# EAGLE design teensyPCB (EAGLE 7.2.0)
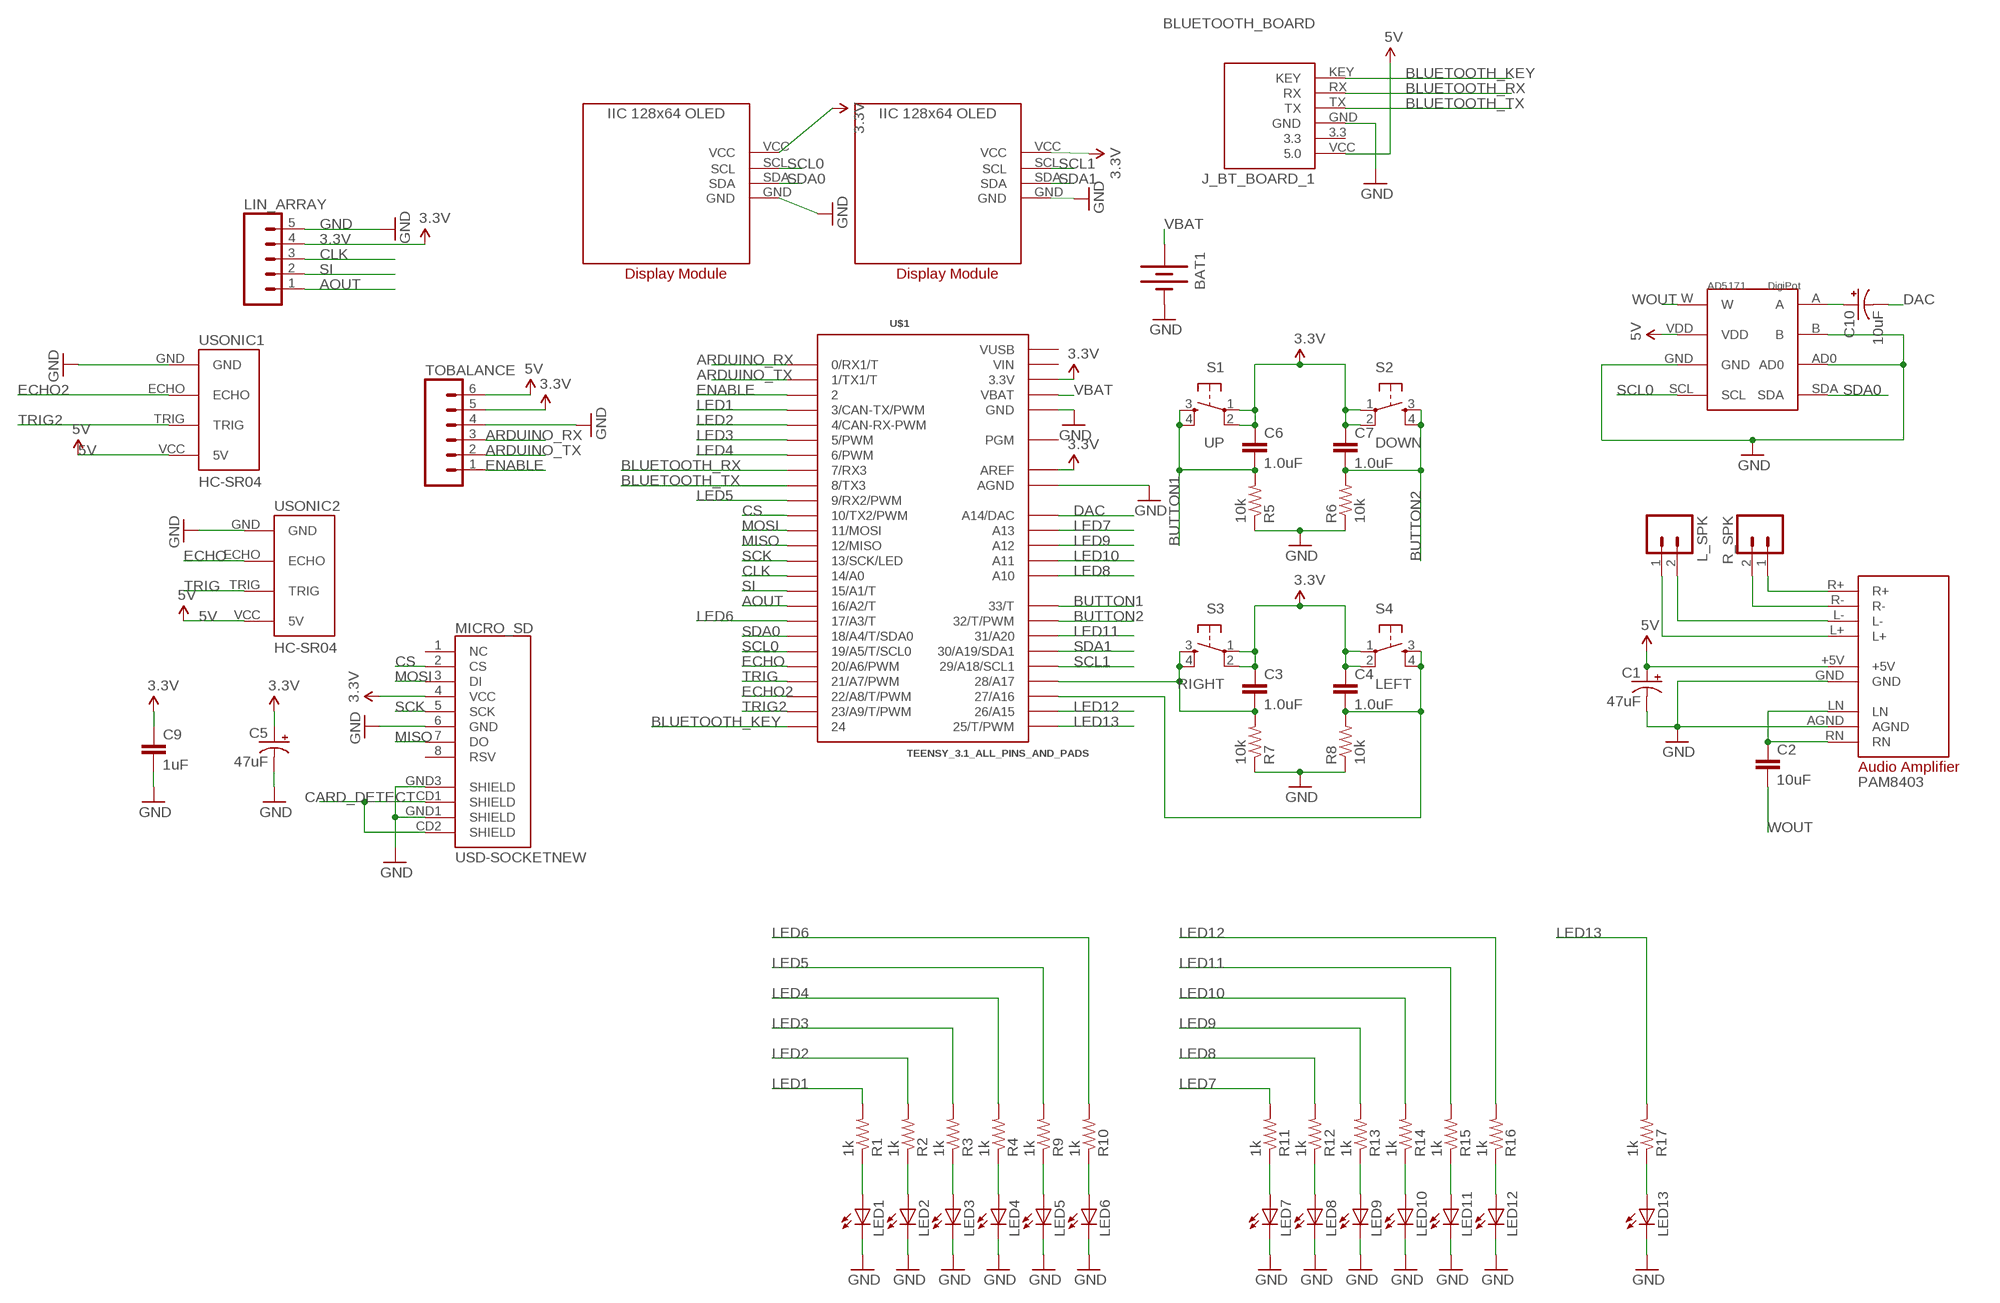
[diagram p0: schematic, sheet 1]

## Parts
BAT1  BATTERY20PTH  [BATTCOM_20MM_PTH]
C1  47uF  CAP_POL3528  [EIA3528]
C2  10uF  1.0UF-25V-+80/-20(0805)  [0805]
C3  1.0uF  1.0UF-25V-+80/-20(0805)  [0805]
C4  1.0uF  1.0UF-25V-+80/-20(0805)  [0805]
C5  47uF  CAP_POL3528  [EIA3528]
C6  1.0uF  1.0UF-25V-+80/-20(0805)  [0805]
C7  1.0uF  1.0UF-25V-+80/-20(0805)  [0805]
C9  1uF  1.0UF-25V-+80/-20(0805)  [0805]
C10  10uF  CAP_POL3528  [EIA3528]
J_BT_BOARD_1  BLUETOOTH_BOARD  [BT_BOARD_FOOTPRINT]
L_SPK  M02PTH  [1X02]
LED1  LEDCHIP-LED0805  [CHIP-LED0805]
LED2  LEDCHIP-LED0805  [CHIP-LED0805]
LED3  LEDCHIP-LED0805  [CHIP-LED0805]
LED4  LEDCHIP-LED0805  [CHIP-LED0805]
LED5  LEDCHIP-LED0805  [CHIP-LED0805]
LED6  LEDCHIP-LED0805  [CHIP-LED0805]
LED7  LEDCHIP-LED0805  [CHIP-LED0805]
LED8  LEDCHIP-LED0805  [CHIP-LED0805]
LED9  LEDCHIP-LED0805  [CHIP-LED0805]
LED10  LEDCHIP-LED0805  [CHIP-LED0805]
LED11  LEDCHIP-LED0805  [CHIP-LED0805]
LED12  LEDCHIP-LED0805  [CHIP-LED0805]
LED13  LEDCHIP-LED0805  [CHIP-LED0805]
LIN_ARRAY  M05LOCK  [1X05_LOCK]
MICRO_SD  USD-SOCKETNEW  [MICRO-SD-SOCKET-PP]
R1  1k  RESISTOR0805-RES  [0805]
R2  1k  RESISTOR0805-RES  [0805]
R3  1k  RESISTOR0805-RES  [0805]
R4  1k  RESISTOR0805-RES  [0805]
R5  10k  RESISTOR0805-RES  [0805]
R6  10k  RESISTOR0805-RES  [0805]
R7  10k  RESISTOR0805-RES  [0805]
R8  10k  RESISTOR0805-RES  [0805]
R9  1k  RESISTOR0805-RES  [0805]
R10  1k  RESISTOR0805-RES  [0805]
R11  1k  RESISTOR0805-RES  [0805]
R12  1k  RESISTOR0805-RES  [0805]
R13  1k  RESISTOR0805-RES  [0805]
R14  1k  RESISTOR0805-RES  [0805]
R15  1k  RESISTOR0805-RES  [0805]
R16  1k  RESISTOR0805-RES  [0805]
R17  1k  RESISTOR0805-RES  [0805]
R_SPK  M02PTH  [1X02]
S1  UP  TAC_SWITCHSMD  [TACTILE-SWITCH-SMD]
S2  DOWN  TAC_SWITCHSMD  [TACTILE-SWITCH-SMD]
S3  RIGHT  TAC_SWITCHSMD  [TACTILE-SWITCH-SMD]
S4  LEFT  TAC_SWITCHSMD  [TACTILE-SWITCH-SMD]
TOBALANCE  M06POLAR_LOCK  [MOLEX-1X6_LOCK]
U$1  TEENSY_3.1_ALL_PINS_AND_PADS  [TEENSY3_ALL_PINS_&_PADS]
U$2  IIC128X64OLED  [IIC128X64OLED]
U$3  IIC128X64OLED  [IIC128X64OLED]
U$4  AUDIOAMPEBAY_VERSION  [AUDIOAMP]
U$5  DIGIPOT  [SOT23-8L]
USONIC1  HC-SR04  [HC-SR04_FOOTPRINT]
USONIC2  HC-SR04  [HC-SR04_FOOTPRINT]

## Nets
3.3V [Power]: C3.1 C4.1 C5.A(+) C6.1 C7.1 C9.1 LIN_ARRAY.4 MICRO_SD.4(VCC) S1.1 S1.2 S2.1 S2.2 S3.1 S3.2 S4.1 S4.2 TOBALANCE.5 U$1.3.3V U$1.3.3V1(3.3V) U$1.3.3V2(3.3V) U$1.AREF U$2.VCC U$3.VCC
5V [Power]: C1.A(+) J_BT_BOARD_1.VCC(5.0) TOBALANCE.6 U$4.+5V U$5.VDD USONIC1.VCC(5V) USONIC2.VCC(5V)
AOUT: LIN_ARRAY.1 U$1.16/A2(16/A2/T)
ARDUINO_RX: TOBALANCE.3 U$1.0(0/RX1/T)
ARDUINO_TX: TOBALANCE.2 U$1.1(1/TX1/T)
BLUETOOTH_KEY: J_BT_BOARD_1.KEY U$1.24
BLUETOOTH_RX: J_BT_BOARD_1.RX U$1.7(7/RX3)
BLUETOOTH_TX: J_BT_BOARD_1.TX U$1.8(8/TX3)
BUTTON1: C6.2 R5.2 S1.3 S1.4 U$1.33(33/T)
BUTTON2: C7.2 R6.2 S2.3 S2.4 U$1.32(32/T/PWM)
BUTTON3: C3.2 R7.2 S3.3 S3.4 U$1.28(28/A17)
BUTTON4: C4.2 R8.2 S4.3 S4.4 U$1.27(27/A16)
CARD_DETECT: MICRO_SD.CD1(SHIELD) MICRO_SD.CD2(SHIELD)
CLK: LIN_ARRAY.3 U$1.14/A0
CS: MICRO_SD.2(CS) U$1.10(10/TX2/PWM)
DAC: C10.C(-) U$1.RESET/DAC(A14/DAC)
ECHO: U$1.20/A6(20/A6/PWM) USONIC2.ECHO
ECHO2: U$1.22/A8(22/A8/T/PWM) USONIC1.ECHO
ENABLE: TOBALANCE.1 U$1.2
GND [Power]: BAT1.2(-) C1.C(-) C5.C(-) C9.2 J_BT_BOARD_1.GND LED1.C LED2.C LED3.C LED4.C LED5.C LED6.C LED7.C LED8.C LED9.C LED10.C LED11.C LED12.C LED13.C LIN_ARRAY.5 MICRO_SD.6(GND) MICRO_SD.GND1(SHIELD) MICRO_SD.GND3(SHIELD) R5.1 R6.1 R7.1 R8.1 TOBALANCE.4 U$1.AGND U$1.GND U$1.GND1(GND) U$1.GND2(GND) U$2.GND U$3.GND U$4.AGND U$4.GND U$5.AD0 U$5.B U$5.GND USONIC1.GND USONIC2.GND
LED1: R1.2 U$1.3(3/CAN-TX/PWM)
LED2: R2.2 U$1.4(4/CAN-RX-PWM)
LED3: R3.2 U$1.5(5/PWM)
LED4: R4.2 U$1.6(6/PWM)
LED5: R9.2 U$1.9(9/RX2/PWM)
LED6: R10.2 U$1.17/A3(17/A3/T)
LED7: R11.2 U$1.A13
LED8: R12.2 U$1.A10
LED9: R13.2 U$1.A12
LED10: R14.2 U$1.A11
LED11: R15.2 U$1.31(31/A20)
LED12: R16.2 U$1.26(26/A15)
LED13: R17.2 U$1.25(25/T/PWM)
MISO: MICRO_SD.7(DO) U$1.12(12/MISO)
MOSI: MICRO_SD.3(DI) U$1.11(11/MOSI)
N$1: C2.1 U$4.LN U$4.RN
N$2: C10.A(+) U$5.A
N$5: R_SPK.1 U$4.R+
N$6: R_SPK.2 U$4.R-
N$7: L_SPK.2 U$4.L-
N$8: L_SPK.1 U$4.L+
N$11: LED1.A R1.1
N$12: LED2.A R2.1
N$13: LED3.A R3.1
N$14: LED4.A R4.1
N$15: LED5.A R9.1
N$16: LED6.A R10.1
N$17: LED7.A R11.1
N$18: LED8.A R12.1
N$19: LED9.A R13.1
N$20: LED10.A R14.1
N$21: LED11.A R15.1
N$22: LED12.A R16.1
N$23: LED13.A R17.1
SCK: MICRO_SD.5(SCK) U$1.13(13/SCK/LED)
SCL0: U$1.19/A5(19/A5/T/SCL0) U$2.SCL U$5.SCL
SCL1: U$1.29(29/A18/SCL1) U$3.SCL
SDA0: U$1.18/A4(18/A4/T/SDA0) U$2.SDA U$5.SDA
SDA1: U$1.30(30/A19/SDA1) U$3.SDA
SI: LIN_ARRAY.2 U$1.15/A1(15/A1/T)
TRIG: U$1.21/A7(21/A7/PWM) USONIC2.TRIG
TRIG2: U$1.23/A9(23/A9/T/PWM) USONIC1.TRIG
VBAT: BAT1.1(+) U$1.VBAT
WOUT: C2.2 U$5.W
Unconnected: J_BT_BOARD_1.3.3 MICRO_SD.1(NC) MICRO_SD.8(RSV) U$1.PGM

## Power pins joined to a net without a drawn wire
VIN: U$1.VIN
VUSB: U$1.VUSB

## Library data of the parts
BAT1 = SparkFun-Electromechanical:BATTERY: Battery Holders Various common sizes : AA, AAA, 18650 (PRT-12895), 20mm coin cell and 12mm coin cell. 20MM_4LEGS, BATT-10373
C1 C5 C10 = SparkFun-Capacitors:CAP_POL: Capacitor Polarized These are standard SMD and PTH capacitors. Normally 10uF, 47uF, and 100uF in electrolytic and tantalum varieties. Always verify the external diameter of the through hole cap, it varies with capacity, voltage, and manufacturer. The EIA devices should be standard.
C2 C9 = SparkFun-Capacitors:1.0UF-25V-+80/-20(0805): CAP-11625; PROD_ID: CAP-11625; VALUE: 1.0uF
C3 C4 C6 C7 = SparkFun-Capacitors:1.0UF-25V-+80/-20(0805): CAP-11625; PROD_ID: CAP-11625
J_BT_BOARD_1 = Bluetooth_HC-05:BLUETOOTH_BOARD: Bluetooth Board V1.05
L_SPK R_SPK = SparkFun-Connectors:M02: Standard 2-pin 0.1" header. Use with - straight break away headers ( PRT-00116) - right angle break away headers (PRT-00553) - swiss pins (PRT-00743) - machine pins (PRT-00117) - female headers (PRT-00115) Molex polarized connector foot print use with: PRT-08233 with associated crimp pins and housings. 2.54_SCREWTERM for use with PRT-10571. 3.5mm Screw Terminal footprints for PRT-08084 5mm Screw Terminal footprints for use with PRT-08432
LED1-LED13 = adafruit:LED: LED OSRAM: - CHIPLED LG R971, LG N971, LY N971, LG Q971, LY Q971, LO R971, LY R971 LH N974, LH R974 LS Q976, LO Q976, LY Q976 LO Q996 - Hyper CHIPLED LW Q18S LB Q993, LB Q99A, LB R99A - SideLED LS A670, LO A670, LY A670, LG A670, LP A670 LB A673, LV A673, LT A673, LW A673 LH A674 LY A675 LS A676, LA A676, LO A676, LY A676, LW A676 LS A679, LY A679, LG A679 - Hyper Micro SIDELED® LS Y876, LA Y876, LO Y876, LY Y876 LT Y87S - SmartLED LW L88C, LW L88S LB L89C, LB L89S, LG L890 LS L89K, LO L89K, LY L89K LS L896, LA L896, LO L896, LY L896 - TOPLED LS T670, LO T670, LY T670, LG T670, LP T670 LSG T670, LSP T670, LSY T670, LOP T670, LYG T670 LG T671, LOG T671, LSG T671 LB T673, LV T673, LT T673, LW T673 LH T674 LS T676, LA T676, LO T676, LY T676, LB T676, LH T676, LSB T676, LW T676 LB T67C, LV T67C, LT T67C, LS T67K, LO T67K, LY T67K, LW E67C LS E67B, LA E67B, LO E67B, LY E67B, LB E67C, LV E67C, LT E67C LW T67C LS T679, LY T679, LG T679 LS T770, LO T770, LY T770, LG T770, LP T770 LB T773, LV T773, LT T773, LW T773 LH T774 LS E675, LA E675, LY E675, LS T675 LS T776, LA T776, LO T776, LY T776, LB T776 LHGB T686 LT T68C, LB T68C - Hyper Mini TOPLED® LB M676 - Mini TOPLED Santana® LG M470 LS M47K, LO M47K, LY M47K Source: http://www.osram.convergy.de/
LIN_ARRAY = SparkFun-Connectors:M05: Header 5 Standard 5-pin 0.1" header. Use with straight break away headers (SKU : PRT-00116), right angle break away headers (PRT-00553), swiss pins (PRT-00743), machine pins (PRT-00117), and female headers (PRT-00115). Molex polarized connector foot print use with SKU : PRT-08230 with associated crimp pins and housings.
MICRO_SD = SparkFun-Connectors:USD-SOCKET: microSD Socket Push-push type uSD socket. Schematic element and footprint production proven. Spark Fun Electronics SKU : PRT-00127. tDoc lines correctly indicate media card edge positions when inserting (unlocked, locked, depressed).
R1-R17 = SparkFun-Resistors:RESISTOR: Resistor Basic schematic elements and footprints for 0603, 1206, and PTH resistors.
S1-S4 = SparkFun-Retired:TAC_SWITCH: Momentary Switch Button commonly used for reset or general input. Spark Fun Electronics SKU : COM-00097 SMT- SWCH-08247; PROD_ID: SWCH-08247; VALUE: TAC_SWITCHSMD
TOBALANCE = SparkFun-Connectors:M06: Header 6 Standard 6-pin 0.1" header. Use with straight break away headers (SKU : PRT-00116), right angle break away headers (PRT-00553), swiss pins (PRT-00743), machine pins (PRT-00117), and female headers (PRT-00115). Molex polarized connector foot print use with SKU : PRT-08094 with associated crimp pins and housings. NOTES ON THE VARIANTS LOCK and LOCK_LONGPADS... This footprint was designed to help hold the alignment of a through-hole component (i.e. 6-pin header) while soldering it into place. You may notice that each hole has been shifted either up or down by 0.005 of an inch from it's more standard position (which is a perfectly straight line). This slight alteration caused the pins (the squares in the middle) to touch the edges of the holes. Because they are alternating, it causes a "brace" to hold the component in place. 0.005 has proven to be the perfect amount of "off-center" position when using our standard breakaway headers. Although looks a little odd when you look at the bare footprint, once you have a header in there, the alteration is very hard to notice. Also,if you push a header all the way into place, it is covered up entirely on the bottom side. This idea of altering the position of holes to aid alignment will be further integrated into the Sparkfun Library for other footprints. It can help hold any component with 3 or more connection pins.
U$1 = Teensy_3_and_LC_Series_Boards_v1.1:TEENSY_3.1_ALL_PINS_AND_PADS: Footprint for Teensy 3.1 or 3.2 board using all pads and all through-holes. Pads need a 2x7 0.1" SMD header.
U$2 U$3 = IIC OLED MODULE LIBRARY:IIC128X64OLED
U$4 = CLASS D AUDIO AMP:AUDIOAMP
U$5 = DigiPot:DIGIPOT
USONIC1 USONIC2 = HC-SR04:HC-SR04: Ultrasonic Sensor HC-SR04

## Net classes
0 default: width 0.254 mm
1 Power: width 0.305 mm

## Board
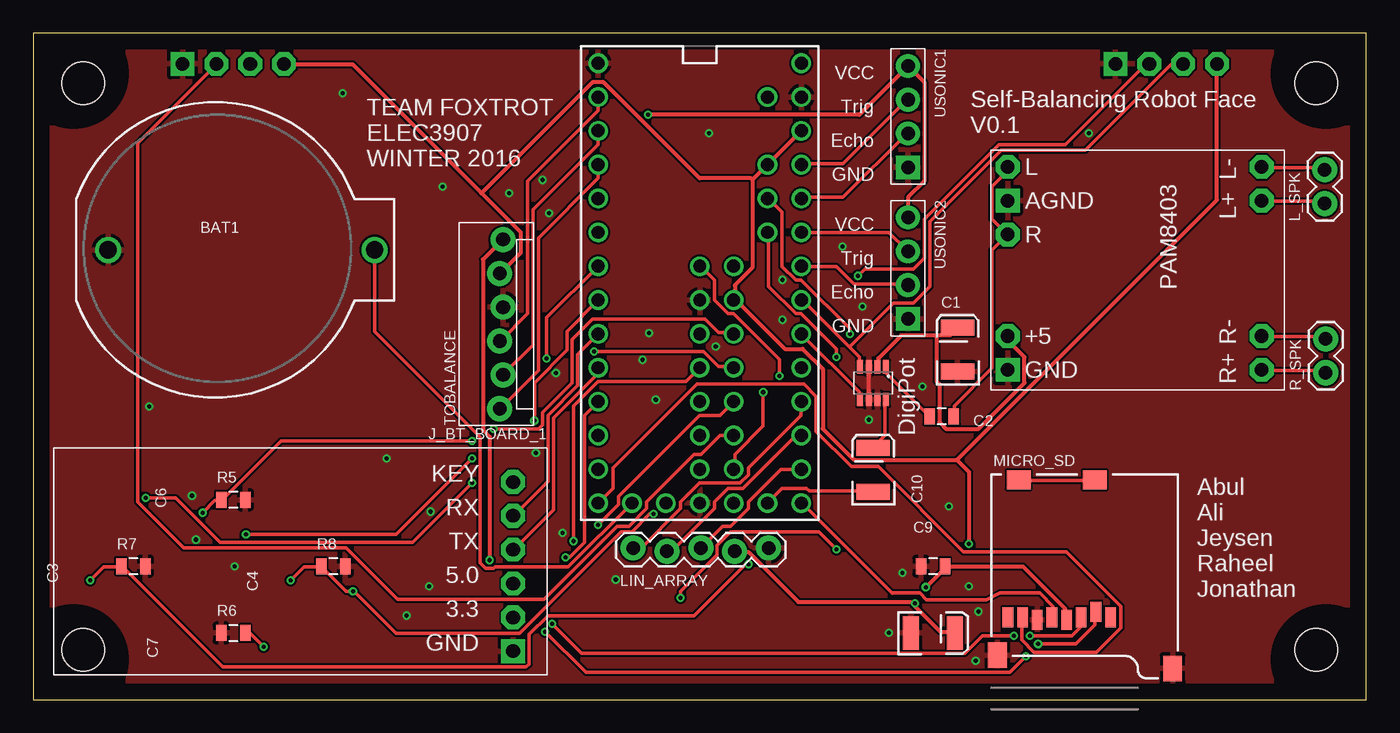
[diagram p1: board, top side]
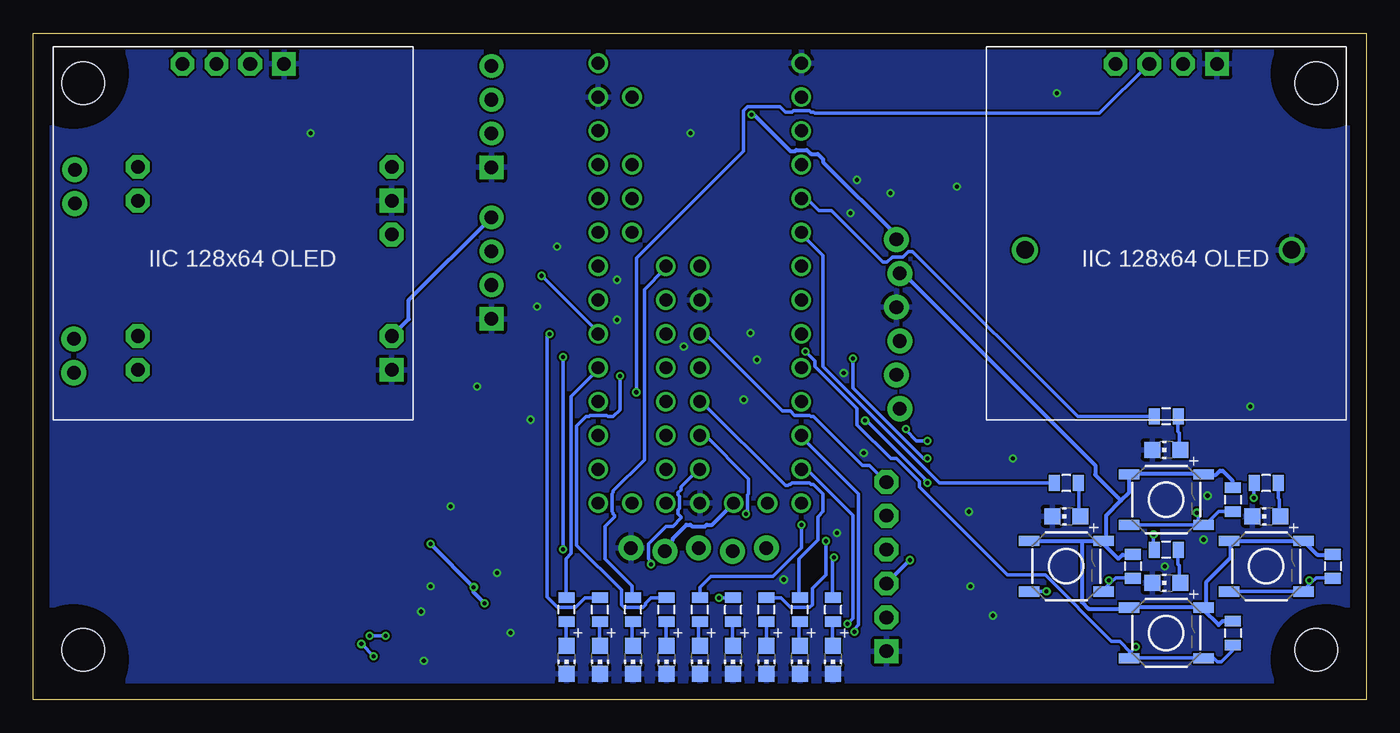
[diagram p2: board, bottom side, seen from below]

Size 100 x 50 mm. Coordinates in mm from the lower left corner, seen from the top.
Outline: 0,0 100,0 100,50 0,50 0,0
Copper layers (1*16): Top 0.035mm / dielectric 1.5mm / Bottom 0.035mm
Design rules "ITEADstudio_DRC": minimum track width 6mil, minimum drill 12mil, track to track 6mil, track to pad 6mil, pad to pad 6mil, via to via 6mil, smd to smd 0mil, copper to edge 10mil, drill to drill 10mil, minimum pad ring 10mil, minimum via ring 6mil, stop-mask expansion 2mil, vias tented up to drill 100mil, thermal gap 10mil
Holes 3.2 mm at 3.75,46.25 96.25,46.25 96.25,3.75 3.75,3.75
tRestrict: area 0,0 to 100,50; area 0.8,0.8 to 5.2,5.2; area 0.8,44.8 to 5.2,49.2; area 94.8,44.8 to 99.2,49.2; area 94.8,0.8 to 99.2,5.2
bRestrict: area 0,0 to 100,50; area 0.8,44.8 to 5.2,49.2; area 0.8,0.8 to 5.2,5.2; area 94.8,44.8 to 99.2,49.2; area 94.8,0.8 to 99.2,5.2

### Footprints (pad centres in the part's own frame; a part is rotated, then mirrored left to right if it is on the bottom)
BATTCOM_20MM_PTH = drill 1.3: 1 11.85,0; 2 -8.15,0
EIA3528 = smd 1.2 x 2.5: A 1.65,0; C -1.65,0
0805 = smd 0.8 x 1.2: 1 -0.9,0; 2 0.9,0
BT_BOARD_FOOTPRINT = drill 1.016 pad 1.778 octagon: 3.3 2.54,12.7; KEY 2.54,2.54; RX 2.54,5.08; TX 2.54,7.62; VCC 2.54,10.16 | drill 1.016 pad 1.778 square: GND 2.54,15.24
1X02 = drill 1.016 pad 1.88: 1 0,0; 2 2.54,0
CHIP-LED0805 = smd 1.2 x 1.2: A 0,-1.05; C 0,1.05
1X05_LOCK = drill 1.016 pad 1.88: 1 0,0.127; 2 2.54,-0.127; 3 5.08,0.127; 4 7.62,-0.127; 5 10.16,0.127
MICRO-SD-SOCKET-PP = smd 0.8 x 1.5: 1 -8.94,10.7; 2 -7.84,10.3; 3 -6.74,10.7; 4 -5.64,10.9; 5 -4.54,10.7; 6 -3.44,10.9; 7 -2.34,10.7; 8 -1.24,10.7 | smd 1.8 x 1.4: CD1 -2.05,0.4; CD2 -7.75,0.4 | smd 1.4 x 1.9: GND1 -13.6,14.55; GND3 -0.45,13.55
TACTILE-SWITCH-SMD = smd 1.524 x 0.762: 1 -2.794,1.905; 2 2.794,1.905; 3 -2.794,-1.905; 4 2.794,-1.905
MOLEX-1X6_LOCK = drill 1.016 pad 1.88: 1 0,0; 2 2.54,-0.254; 3 5.08,0; 4 7.62,-0.254; 5 10.16,0; 6 12.7,-0.254
TEENSY3_ALL_PINS_&_PADS = drill 0.965: 0 -7.62,13.97; 1 -7.62,11.43; 2 -7.62,8.89; 3 -7.62,6.35; 3.3V 7.62,11.43; 3.3V1 -2.54,-16.51; 3.3V2 2.54,-1.27; 4 -7.62,3.81; 5 -7.62,1.27; 6 -7.62,-1.27; 7 -7.62,-3.81; 8 -7.62,-6.35; 9 -7.62,-8.89; 10 -7.62,-11.43; 11 -7.62,-13.97; 12 -7.62,-16.51; 13 7.62,-16.51; 14/A0 7.62,-13.97; 15/A1 7.62,-11.43; 16/A2 7.62,-8.89; 17/A3 7.62,-6.35; 18/A4 7.62,-3.81; 19/A5 7.62,-1.27; 20/A6 7.62,1.27; 21/A7 7.62,3.81; 22/A8 7.62,6.35; 23/A9 7.62,8.89; 24 0,-3.81; 25 0,-6.35; 26 0,-8.89; 27 0,-11.43; 28 0,-13.97; 29 2.54,-13.97; 30 2.54,-11.43; 31 2.54,-8.89; 32 2.54,-6.35; 33 2.54,-3.81; A10 5.08,6.35; A11 5.08,3.81; A12 0,1.27; A13 2.54,1.27; AGND 7.62,13.97; AREF 5.08,8.89; GND -7.62,16.51; GND1 0,-16.51; GND2 0,-1.27; PGM 2.54,-16.51; RESET/DAC 5.08,-16.51; VBAT -5.08,-16.51; VIN 7.62,16.51; VUSB 5.08,13.97
IIC128X64OLED = drill 1.016 pad 1.778 square: GND 3.81,12.7 | drill 1.016 pad 1.778 octagon: SCL -1.27,12.7; SDA 1.27,12.7; VCC -3.81,12.7
AUDIOAMP = drill 1.016 pad 1.778 octagon: +5V 13.97,1.27; L+ 3.81,20.32; L- 1.27,20.32; LN 1.27,1.27; R+ 16.51,20.32; R- 13.97,20.32; RN 6.35,1.27 | drill 1.016 pad 1.778 square: AGND 3.81,1.27; GND 16.51,1.27
SOT23-8L = smd 0.45 x 1: A -0.975,1.225; AD0 0.325,1.225; B -0.325,1.225; GND 0.325,-1.225; SCL 0.975,-1.225; SDA 0.975,1.225; VDD -0.325,-1.225; W -0.975,-1.225
HC-SR04_FOOTPRINT = drill 1.016 pad 1.778: ECHO 0,1.27; TRIG 0,-1.27; VCC 0,-3.81 | drill 1.016 pad 1.778 square: GND 0,3.81

### Placement (x,y rotation side)
BAT1  13.75,33.75 0 top
C1  69.34,26.26 90 top
C2  68.14,21.25 180 top
C3  2.5,10 270 bottom
C4  17.5,10 270 bottom
C5  67.5,5 0 top
C6  10,15 270 bottom
C7  10,5 270 bottom
C9  67.5,10 180 top
C10  63,17.25 90 top
J_BT_BOARD_1  38.53,18.86 180 top
L_SPK  96.89,37.23 90 top
LED1  15,18.75 90 bottom
LED2  22.5,13.75 90 bottom
LED3  15,8.75 90 bottom
LED4  7.5,13.75 90 bottom
LED5  40,3 180 bottom
LED6  60,3 180 bottom
LED7  55,3 180 bottom
LED8  57.5,3 180 bottom
LED9  52.5,3 180 bottom
LED10  47.5,3 180 bottom
LED11  50,3 180 bottom
LED12  42.5,3 180 bottom
LED13  45,3 180 bottom
LIN_ARRAY  45,11.25 0 top
MICRO_SD  71.88,16.89 180 top
R1  15,21.25 180 bottom
R2  22.5,16.25 180 bottom
R3  15,11.25 180 bottom
R4  7.5,16.25 180 bottom
R5  15,15 180 top
R6  15,5 0 top
R7  7.5,10 180 top
R8  22.5,10 180 top
R9  40,6.75 90 bottom
R10  60,6.75 90 bottom
R11  55,6.75 90 bottom
R12  57.5,6.75 90 bottom
R13  52.5,6.75 90 bottom
R14  47.5,6.75 90 bottom
R15  50,6.75 90 bottom
R16  42.5,6.75 90 bottom
R17  45,6.75 90 bottom
R_SPK  96.95,24.52 90 top
S1  15,15 0 bottom
S2  15,5 0 bottom
S3  7.5,10 0 bottom
S4  22.5,10 0 bottom
TOBALANCE  34.99,21.82 90 top
U$1  50,31.25 0 top
U$2  85,35 0 bottom
U$3  15,35 0 bottom
U$4  71.84,41.25 270 top
U$5  63,23.75 180 top
USONIC1  65.62,43.75 180 top
USONIC2  65.62,32.38 180 top

### Tracks (layer width: path | path; a pad name or v marks a point on that pad's centre or on a via)
3.3V  (via drill 0.3)
  Top 0.305: 33.63,38 36.58,35.05 36.58,33.53 35.05,32 TOBALANCE.5 | 33.63,38 23.98,47.65 18.9,47.65 U$3.VCC | MICRO_SD.4 77.42,5.99 77.42,6.81 74.27,9.96 68.48,9.96 C9.1 68.38,9.86 v66.95,8.43 | 66.04,7.11 65.84,7.32 57.4,7.32 53.65,11.07 52.63,11.07 LIN_ARRAY.4 | 66.04,7.11 68.07,5.08 69.09,5.08 C5.A | v66.14,7.21 66.04,7.11 | 53.95,39.01 53.95,32.41 52.63,31.09 52.63,30.07 U$1.3.3V2 52.73,29.97 56.39,26.31 57.71,26.31 59.23,24.79 59.23,20.32 61.57,17.98 69.29,17.98 | 53.95,39.01 55.07,40.13 U$1.AREF 55.17,40.23 57.61,42.67 U$1.3.3V | 69.29,17.98 88.8,37.49 88.8,47.65 U$2.VCC | v70.21,11.68 70.21,17.07 69.29,17.98 | 33.63,38 41.96,46.33 42.77,46.33 49.99,39.12 53.85,39.12 53.95,39.01
  Bottom 0.305: C3.1 2.54,10.87 3.66,10.87 4.67,11.89 S3.2 4.78,11.89 10.26,11.89 S3.1 10.16,11.79 10.16,10.67 11.99,8.84 11.99,7.21 12.19,7.01 S2.2 | C7.1 10.06,5.89 10.77,5.89 11.07,5.59 12.29,6.81 S2.2 | S2.2 12.39,6.91 S2.1 17.88,6.81 20.83,6.81 21.34,7.32 21.34,11.89 | C6.1 10.06,15.95 10.06,16.46 10.77,17.17 10.97,17.17 11.28,16.87 12.19,16.87 S1.2 12.29,16.97 17.68,16.97 S1.1 17.78,16.87 17.78,15.54 18.39,14.94 | C4.1 17.58,10.87 18.29,10.87 18.59,10.57 19.61,11.58 19.61,11.89 S4.2 | 18.39,14.94 19.51,13.82 19.51,11.99 S4.2 | 21.34,11.89 19.81,11.89 S4.2 | 21.34,11.89 25.2,11.89 S4.1 | 18.39,14.94 20.32,16.87 20.32,17.58 34.65,31.9 34.95,31.9 TOBALANCE.5 | U$1.3.3V1 47.55,14.73 47.85,14.43 47.85,14.33 49.07,13.11 49.48,13.11 49.58,13.01 50.6,13.01 50.7,13.11 51,13.11 52.02,12.09 52.02,11.99 52.53,11.48 52.53,11.18 LIN_ARRAY.4 | v66.14,7.21 66.95,8.03 v66.95,8.43 v70.21,11.68
5V  (via drill 0.3)
  Top 0.305: v34.24,10.46 34.24,19.71 33.73,20.22 33.73,33.02 35.15,34.44 TOBALANCE.6 | USONIC2.VCC 65.63,36.27 65.63,37.69 66.85,38.91 66.85,46.33 65.63,47.55 USONIC1.VCC 65.53,47.45 61.98,43.89 v46.13,43.89 | 67.77,27.33 68.78,27.33 69.29,27.84 C1.A | 67.77,27.33 65.13,27.33 63.4,25.6 63.4,24.99 U$5.VDD | 67.77,27.33 67.77,23.88 67.97,23.67 67.97,20.83 68.48,20.32 70.92,20.32 74.37,23.77 74.37,25.7 73.15,26.92 73.15,27.23 U$4.+5V
  Bottom 0.305: v34.24,10.46 35.97,8.74 J_BT_BOARD_1.VCC | USONIC2.VCC 65.63,36.17 71.83,29.97 71.83,28.55 73.05,27.33 U$4.+5V | v46.13,43.89 45.92,43.89 43.18,41.15 42.88,41.15 42.77,41.25 41.96,41.25 41.66,40.95 41.15,40.95 40.74,40.54 40.74,40.34 35.26,34.85 35.26,34.54 TOBALANCE.6
AOUT
  Top 0.254: U$1.16/A2 57.61,22.35 57.61,21.34 53.65,17.37 53.65,16.87 53.03,16.26 49.99,16.26 48.56,14.83 48.56,14.33 45.62,11.38 LIN_ARRAY.1
ARDUINO_RX
  Top 0.254: U$1.0 42.37,45.21 42.37,44.2 37.08,38.91 37.08,28.96 35.05,26.92 TOBALANCE.3
ARDUINO_TX
  Top 0.254: U$1.1 42.37,42.67 42.37,41.66 37.49,36.78 37.49,26.62 35.26,24.38 TOBALANCE.2
BLUETOOTH_KEY
  Bottom 0.254: U$1.24 49.99,27.43 49.58,27.43 43.79,21.64 43.18,21.64 42.88,21.34 41.76,21.34 41.66,21.23 41.45,21.23 37.8,17.58 37.29,17.58 36.07,16.36 J_BT_BOARD_1.KEY
BLUETOOTH_RX
  Top 0.254: U$1.7 42.37,27.43 40.84,25.91 40.84,23.57 38.61,21.34 38.61,16.36 36.07,13.82 J_BT_BOARD_1.RX
BLUETOOTH_TX
  Top 0.254: U$1.8 42.37,24.89 42.37,24.49 39.01,21.13 39.01,14.22 36.07,11.28 J_BT_BOARD_1.TX
BUTTON1  (via drill 0.3)
  Top 0.254: v12.7,14.02 13.61,14.94 14.02,14.94 R5.2 14.22,15.04 18.59,19.41 v32.92,19.41 | v34.54,20.32 37.9,20.32 38.2,20.62 38.2,21.54 40.44,23.77 40.44,27.03 41.96,28.55 50.39,28.55 51.41,27.53 52.53,27.53 U$1.33
  Bottom 0.254: C6.2 10.06,14.12 11.07,14.12 12.19,13.01 S1.4 | v12.7,14.02 12.6,13.92 12.6,13.41 12.29,13.11 S1.4 | S1.3 12.8,13.11 12.6,13.31 S1.4 | v34.54,20.32 34.54,20.22 33.73,19.41 v32.92,19.41
BUTTON2  (via drill 0.3)
  Top 0.254: v17.27,3.96 16.26,4.98 15.95,4.98 R6.2 | v42.06,26.11 50.29,26.11 51.41,24.99 52.53,24.99 U$1.32
  Bottom 0.254: C7.2 10.06,4.06 10.06,3.66 10.87,2.85 11.18,2.85 11.48,3.15 12.19,3.15 S2.4 12.29,3.15 17.68,3.15 S2.3 17.88,3.15 17.88,3.35 17.68,3.56 | 17.68,3.56 v17.27,3.96 | v42.06,26.11 41.35,25.4 41.35,24.99 38.2,21.84 38.2,20.62 35.66,18.09 35.26,18.09 33.53,16.36 33.53,15.95 26.92,9.35 24.08,9.35 19.1,4.37 18.49,4.37 17.68,3.56
BUTTON3  (via drill 0.3)
  Top 0.254: v4.27,8.94 5.28,9.96 6.5,9.96 R7.2 6.71,9.96 14.22,2.44 36.98,2.44 37.19,2.64 37.19,4.88 38.61,6.3 49.58,6.3 53.44,10.16 v53.65,10.16
  Bottom 0.254: 4.12,8.79 4.78,8.13 S3.4 4.88,8.13 10.26,8.13 S3.3 | 4.12,8.79 3.76,9.14 2.54,9.14 C3.2 | 4.12,8.79 v4.27,8.94 | v53.65,10.16 53.54,10.26 53.85,10.57 53.85,11.68 52.53,13.01 52.02,13.01 51.41,13.61 51.41,13.72 51.61,13.92 51.61,14.22 51.51,14.33 51.51,15.24 51.61,15.34 51.61,15.54 51.41,15.75 51.41,15.95 50.09,17.27 U$1.28
BUTTON4  (via drill 0.3)
  Top 0.254: v19.3,8.94 20.32,9.96 21.54,9.96 R8.2 21.64,9.96 23.47,8.13 v23.98,8.13 24.08,8.13 27.23,4.98 36.47,4.98 44.09,12.6 44.91,12.6 46.23,13.92 v46.53,13.92
  Bottom 0.254: 19.15,8.79 19.61,8.33 19.61,8.13 S4.4 | 19.15,8.79 18.8,9.14 17.58,9.14 C4.2 | 19.15,8.79 v19.3,8.94 | v23.98,8.13 25.2,8.13 S4.3 | v46.53,13.92 46.43,14.02 46.43,15.34 46.33,15.44 46.33,16.56 49.58,19.81 49.99,19.81 U$1.27
CARD_DETECT
  Top 0.254: MICRO_SD.CD1 73.97,16.46 79.55,16.46 MICRO_SD.CD2
CLK
  Top 0.254: U$1.14/A0 57.61,17.27 56.08,17.27 53.65,14.83 53.65,14.33 52.32,13.01 51.71,13.01 LIN_ARRAY.3
CS  (via drill 0.3)
  Top 0.254: v75.39,4.17 78.23,4.17 79.65,5.59 79.65,6.5 MICRO_SD.2 | v74.47,3.25 73.25,2.03 41.45,2.03 v38.41,5.08
  Bottom 0.254: v74.47,3.25 v75.39,4.17 | v38.41,5.08 38.41,5.28 38.1,5.59 38.1,15.44 42.47,19.81 U$1.10
DAC
  Top 0.254: C10.C 62.99,15.65 58.22,15.65 58.01,15.85 56.19,15.85 55.17,14.83 U$1.RESET/DAC
ECHO
  Top 0.254: U$1.20/A6 57.71,32.51 60.25,32.51 61.57,31.19 65.53,31.19 USONIC2.ECHO
ECHO2
  Top 0.254: U$1.22/A8 57.71,37.69 60.76,37.69 65.53,42.47 USONIC1.ECHO
ENABLE
  Top 0.254: U$1.2 42.37,40.13 42.37,39.12 37.9,34.65 37.9,24.69 35.05,21.84 TOBALANCE.1
GND  (via drill 0.3)
  Top 0.305: U$5.AD0 U$5.GND | 63.4,22.55 U$5.B 63.4,22.55
  other vias: 15.1,10 26.5,18.1 28,6.3 64.2,5 70.7,2.9 70.9,6.6 65.2,9.5 8.7,22 23.2,45.5 30.7,38.5 50.7,42.5 35.7,38 38.2,39 38.7,36.5 29.7,8.5 70.2,8.5 68.7,14.5 66.7,23.5 62.7,21 62.2,29.5 60.7,34 79.2,42.5 12.2,12 39.7,12.5 46.7,22.5 45.7,25.5 46.2,27.5 51.2,26.5 56.2,28.5 56.2,31.5 43.7,9 39.2,24.5 37.7,18.5 29.8,14.1 11.9,15.3
  pour Bottom: -2.5,51.25 101.25,51.25 101.25,-1.25 -2.5,-1.25
  pour Top: -1.25,51.25 101.25,51.25 101.25,-1.25 -1.25,-1.25
LED1
  Bottom 0.254: R1.2 15.95,21.23 21.64,21.23 34.04,33.63 34.34,33.63 34.75,33.22 35.56,33.22 35.97,32.82 36.27,32.82 40.13,36.68 41.05,36.68 41.96,37.59 42.37,37.59 U$1.3
LED2
  Bottom 0.254: R2.2 23.47,16.26 32,16.26 40.74,24.99 40.74,33.33 42.47,35.05 U$1.4
LED3  (via drill 0.3)
  Top 0.254: v15.95,12.39 27.23,12.39 v32.92,18.09 | v38.51,25.6 38.51,28.65 42.37,32.51 U$1.5
  Bottom 0.254: v15.95,12.39 15.95,11.28 R3.2 | v32.92,18.09 33.22,18.09 38.51,23.37 v38.51,25.6
LED4  (via drill 0.3)
  Top 0.254: v8.43,15.14 10.67,15.14 14.02,11.79 28.45,11.79 v32.92,16.26 | v37.59,20.93 37.59,23.77 40.03,26.21 40.03,27.64 42.37,29.97 U$1.6
  Bottom 0.254: v8.43,15.14 8.43,16.15 R4.2 | v32.92,16.26 33.12,16.46 33.12,16.56 37.49,20.93 v37.59,20.93
LED5  (via drill 0.3)
  Top 0.254: v39.93,10.67 40.23,10.67 41.35,11.79 41.35,21.34 42.37,22.35 U$1.9
  Bottom 0.254: v39.93,10.67 40.03,10.57 40.03,7.72 R9.2
LED6
  Bottom 0.254: R10.2 60.05,7.72 60.05,10.57 59.64,10.97 59.64,22.76 57.71,24.69 57.71,24.89 U$1.17/A3
LED7
  Bottom 0.254: R11.2 55.07,7.72 55.07,8.53 57.1,10.57 57.1,13.01 56.39,13.72 56.39,13.82 56.49,13.92 56.49,14.02 56.59,14.12 56.59,15.44 56.49,15.54 56.49,15.65 54.15,17.98 54.15,30.79 52.63,32.31 52.63,32.51 U$1.A13
LED8  (via drill 0.3)
  Top 0.254: v61.27,27.43 61.27,27.84 57.61,31.5 57.2,31.5 56.19,32.51 56.19,36.58 55.17,37.59 U$1.A10
  Bottom 0.254: v61.27,27.43 61.47,27.23 61.47,7.72 60.66,6.91 59.33,6.91 58.62,7.62 57.51,7.62 R12.2
LED9  (via drill 0.3)
  Top 0.254: v55.98,24.28 55.98,25.5 52.53,28.96 52.12,28.96 51.1,29.97 51.1,31.5 50.09,32.51 U$1.A12
  Bottom 0.254: v55.98,24.28 55.98,21.74 56.49,21.23 56.9,21.23 57,21.34 58.22,21.34 58.32,21.23 58.52,21.23 59.23,20.52 59.23,11.58 55.88,8.23 55.88,7.11 55.68,6.91 54.25,6.91 54.05,7.11 54.05,7.21 53.65,7.62 52.53,7.62 R13.2
LED10  (via drill 0.3)
  Top 0.254: v48.56,7.62 48.56,8.13 51.31,10.87 51.31,11.58 52.32,12.6 58.93,12.6 v60.25,11.28 | v60.25,25.7 60.25,26.31 57.61,28.96 57.2,28.96 55.17,30.99 55.17,35.05 U$1.A11
  Bottom 0.254: v48.56,7.62 47.55,7.62 R14.2 | v60.25,25.7 v60.25,11.28
LED11  (via drill 0.3)
  Top 0.254: v42.37,13.11 43.89,14.63 43.89,15.24 49.99,21.34 51.51,21.34 52.53,22.35 U$1.31
  Bottom 0.254: v42.37,13.11 42.37,11.38 44.5,9.25 49.17,9.25 49.99,8.43 49.99,7.72 R15.2
LED12
  Bottom 0.254: R16.2 42.57,7.72 42.57,10.57 41.15,11.99 41.15,13.72 40.74,14.12 40.74,15.44 41.45,16.15 41.66,16.15 41.76,16.26 43.08,16.26 43.18,16.15 43.28,16.15 43.38,16.05 43.59,16.05 49.99,22.45 U$1.26
LED13  (via drill 0.3)
  Top 0.254: v40.54,11.89 40.54,22.05 42.37,23.88 48.97,23.88 49.99,24.89 U$1.25
  Bottom 0.254: v40.54,11.89 40.54,9.35 41.55,8.33 41.55,7.11 41.76,6.91 43.18,6.91 43.89,7.62 44.91,7.62 R17.2
MISO
  Top 0.254: MICRO_SD.7 74.17,6.1 74.17,4.47 75.08,3.56 79.76,3.56 81.58,5.38 81.58,7.01 77.52,11.07 69.8,11.07 63.4,17.48 61.37,17.48 58.73,20.12 58.73,22.76 57.81,23.67 49.78,23.67 43.48,17.37 43.48,15.85 42.47,14.83 U$1.12
MOSI  (via drill 0.3)
  Top 0.254: v74.78,4.78 77.93,4.78 78.54,5.38 78.54,6.1 MICRO_SD.3 | v73.56,4.78 71.22,4.78 69.9,3.45 41.15,3.45 v38.91,5.69
  Bottom 0.254: v73.56,4.78 v74.78,4.78 | v38.91,5.69 38.51,6.1 38.51,13.82 41.96,17.27 42.37,17.27 U$1.11
N$1
  Top 0.254: C2.1 69.09,21.34 69.09,22.05 71.93,24.89 71.93,33.73 73.05,34.85 U$4.RN 73.05,34.95 71.93,36.07 71.93,38.51 73.05,39.62 73.05,39.93 U$4.LN
N$2
  Top 0.254: U$5.A 63.91,22.45 63.91,19.81 63.09,19 C10.A
N$5
  Top 0.254: U$4.R+ 92.25,24.69 96.83,24.69 96.93,24.59 R_SPK.1
N$6
  Top 0.254: U$4.R- 92.25,27.23 96.83,27.23 96.93,27.13 R_SPK.2
N$7
  Top 0.254: U$4.L- 92.25,39.93 96.72,39.93 96.83,39.83 L_SPK.2
N$8
  Top 0.254: U$4.L+ 92.25,37.39 96.72,37.39 96.83,37.29 L_SPK.1
N$11
  Bottom 0.254: LED1.A 14.02,18.8 14.02,20.02 14.12,20.12 14.12,21.23 R1.1
N$12
  Bottom 0.254: LED2.A 21.54,13.82 21.54,16.15 R2.1
N$13
  Bottom 0.254: LED3.A 14.02,8.84 14.02,10.06 14.12,10.16 14.12,11.18 R3.1
N$14
  Bottom 0.254: LED4.A 6.5,13.82 6.5,15.04 6.6,15.14 6.6,16.15 R4.1
N$15
  Bottom 0.254: LED5.A 40.03,4.06 40.03,5.79 R9.1
N$16
  Bottom 0.254: LED6.A 60.05,4.06 60.05,5.79 R10.1
N$17
  Bottom 0.254: LED7.A 55.07,4.06 55.07,5.79 R11.1
N$18
  Bottom 0.254: LED8.A 57.51,4.06 57.51,5.79 R12.1
N$19
  Bottom 0.254: LED9.A 52.53,4.06 52.53,5.79 R13.1
N$20
  Bottom 0.254: LED10.A 47.55,4.06 47.55,5.79 R14.1
N$21
  Bottom 0.254: LED11.A 50.09,4.06 50.09,5.79 R15.1
N$22
  Bottom 0.254: LED12.A 42.57,4.06 42.57,5.79 R16.1
N$23
  Bottom 0.254: LED13.A 45.01,4.06 45.01,5.79 R17.1
SCK
  Top 0.254: 76.4,6.5 76.4,6.2 MICRO_SD.5 76.5,6.5 76.5,7 75.5,8 72.5,8 71.5,7.5 67,7.5 66.5,8 64.5,8 64.47,7.97 57.71,14.73 U$1.13
SCL0
  Top 0.254: 61.21,26.47 57.71,29.97 U$1.19/A5 | 61.21,26.47 61.98,25.7 61.98,24.99 U$5.SCL | 61.21,26.47 64.52,29.77 66.04,29.77 67.26,30.99 67.26,35.87 72.64,41.25 78.94,41.25 85.34,47.65 86.26,47.65 U$2.SCL
SCL1  (via drill 0.3)
  Top 0.254: v54.76,23.06 54.76,20.52 52.63,18.39 52.63,17.37 U$1.29
  Bottom 0.254: v54.76,23.06 54.76,33.12 46.74,41.15 46.74,44.2 46.43,44.5 43.99,44.5 43.59,44.09 43.08,44.09 42.98,44.2 41.76,44.2 41.66,44.09 41.45,44.09 41.35,43.99 20.02,43.99 16.36,47.65 U$3.SCL
SDA0  (via drill 0.3)
  Top 0.254: U$5.SDA 61.98,22.55 61.98,23.06 57.61,27.43 U$1.18/A4 | v61.87,31.8 62.38,32.31 66.04,32.31 66.85,33.12 66.85,36.07 72.44,41.66 77.42,41.66 83.41,47.65 83.72,47.65 U$2.SDA
  Bottom 0.254: v61.87,31.8 57.61,27.53 U$1.18/A4
SDA1
  Top 0.254: U$1.30 52.53,19.81 51.51,19.81 50.09,18.39 49.58,18.39 46.02,14.83 46.02,14.33 44.7,13.01 43.79,13.01 38.3,7.52 27.33,7.52 23.47,11.38 11.28,11.38 7.82,14.83 7.82,41.76 13.72,47.65 U$3.SDA
SI
  Top 0.254: U$1.15/A1 57.61,19.81 57.2,19.81 53.24,15.85 52.12,15.85 51.1,14.83 51.1,14.33 47.95,11.18 47.55,11.18 LIN_ARRAY.2
TRIG
  Top 0.254: U$1.21/A7 57.71,35.05 64.21,35.05 65.53,33.73 USONIC2.TRIG
TRIG2
  Top 0.254: U$1.23/A9 57.71,40.23 60.76,40.23 65.53,45.01 USONIC1.TRIG
VBAT
  Top 0.254: U$1.VBAT 44.91,14.73 40.13,9.96 34.65,9.96 34.54,9.86 33.93,9.86 33.53,10.26 33.53,19.71 25.6,27.64 25.6,33.73 BAT1.1
WOUT
  Top 0.254: U$5.W 64.01,24.89 64.01,24.49 67.16,21.34 C2.2

### Text on the board
tNames: Self-Balancing Robot Face / V0.1 | TEAM FOXTROT / ELEC3907 / WINTER 2016 | Abul / Ali / Jeysen / Raheel / Jonathan